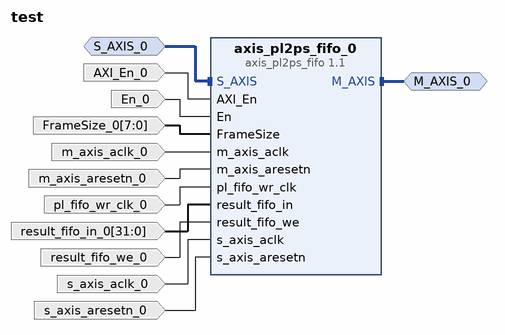
[diagram p0: block diagram of the top level]
# Vivado block design test, xczu7ev-ffvc1156-2-e, Vivado 2019.2
create_bd_design test

create_bd_intf_port -mode Master -vlnv xilinx.com:interface:axis_rtl:1.0 M_AXIS_0
create_bd_intf_port -mode Slave -vlnv xilinx.com:interface:axis_rtl:1.0 S_AXIS_0
set_property -dict [list \
  CONFIG.TDATA_NUM_BYTES 4 \
  CONFIG.TDEST_WIDTH 0 \
  CONFIG.TID_WIDTH 0 \
  CONFIG.TUSER_WIDTH 0 \
  CONFIG.HAS_TREADY 1 \
  CONFIG.HAS_TSTRB 1 \
  CONFIG.HAS_TKEEP 0 \
  CONFIG.HAS_TLAST 1 \
  CONFIG.LAYERED_METADATA undef \
] [get_bd_intf_ports S_AXIS_0]
create_bd_port -dir I AXI_En_0
create_bd_port -dir I En_0
create_bd_port -dir I -from 7 -to 0 FrameSize_0
create_bd_port -dir I -type clk m_axis_aclk_0
create_bd_port -dir I -type rst m_axis_aresetn_0
create_bd_port -dir I -type clk pl_fifo_wr_clk_0
create_bd_port -dir I -from 31 -to 0 result_fifo_in_0
create_bd_port -dir I result_fifo_we_0
create_bd_port -dir I -type clk s_axis_aclk_0
create_bd_port -dir I -type rst s_axis_aresetn_0

create_bd_cell -type ip -vlnv xilinx.com:user:axis_pl2ps_fifo:1.1 axis_pl2ps_fifo_0

# ---- connections ----

connect_bd_intf_net -intf_net S_AXIS_0_1 [get_bd_intf_ports S_AXIS_0] [get_bd_intf_pins axis_pl2ps_fifo_0/S_AXIS]
connect_bd_intf_net [get_bd_intf_ports M_AXIS_0] [get_bd_intf_pins axis_pl2ps_fifo_0/M_AXIS]
connect_bd_net -net AXI_En_0_1 [get_bd_ports AXI_En_0] [get_bd_pins axis_pl2ps_fifo_0/AXI_En]
connect_bd_net -net En_0_1 [get_bd_ports En_0] [get_bd_pins axis_pl2ps_fifo_0/En]
connect_bd_net -net FrameSize_0_1 [get_bd_ports FrameSize_0] [get_bd_pins axis_pl2ps_fifo_0/FrameSize]
connect_bd_net -net m_axis_aclk_0_1 [get_bd_ports m_axis_aclk_0] [get_bd_pins axis_pl2ps_fifo_0/m_axis_aclk]
connect_bd_net -net m_axis_aresetn_0_1 [get_bd_ports m_axis_aresetn_0] [get_bd_pins axis_pl2ps_fifo_0/m_axis_aresetn]
connect_bd_net -net pl_fifo_wr_clk_0_1 [get_bd_ports pl_fifo_wr_clk_0] [get_bd_pins axis_pl2ps_fifo_0/pl_fifo_wr_clk]
connect_bd_net -net result_fifo_in_0_1 [get_bd_ports result_fifo_in_0] [get_bd_pins axis_pl2ps_fifo_0/result_fifo_in]
connect_bd_net -net result_fifo_we_0_1 [get_bd_ports result_fifo_we_0] [get_bd_pins axis_pl2ps_fifo_0/result_fifo_we]
connect_bd_net -net s_axis_aclk_0_1 [get_bd_ports s_axis_aclk_0] [get_bd_pins axis_pl2ps_fifo_0/s_axis_aclk]
connect_bd_net -net s_axis_aresetn_0_1 [get_bd_ports s_axis_aresetn_0] [get_bd_pins axis_pl2ps_fifo_0/s_axis_aresetn]

validate_bd_design
save_bd_design
